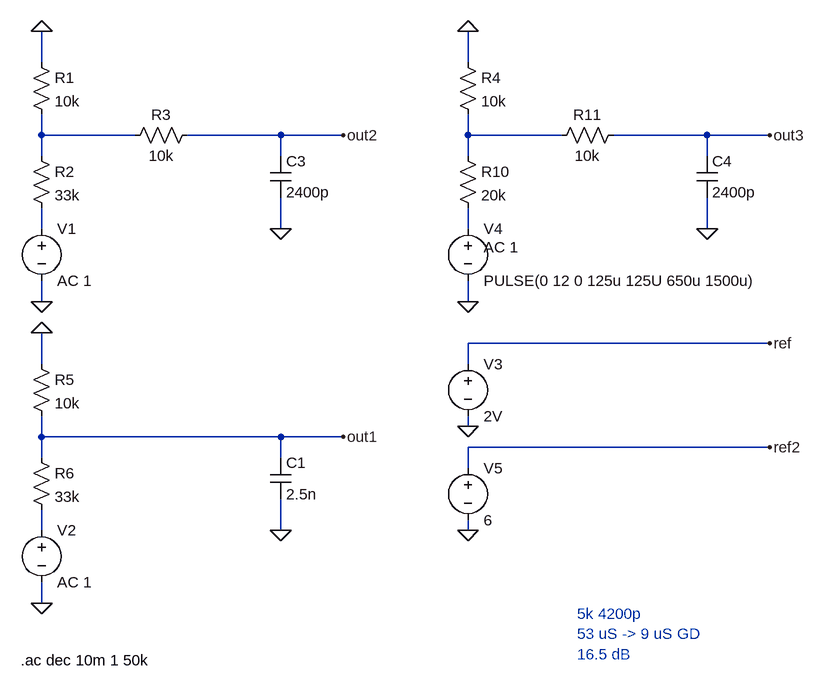
[diagram p0: schematic BEMF_Filter.asc]
BEMF_Filter.asc, the LTspice schematic file:
Version 4
SHEET 1 1400 680
WIRE 48 -960 48 -1008
WIRE 704 -960 704 -1008
WIRE 48 -848 48 -880
WIRE 192 -848 48 -848
WIRE 416 -848 272 -848
WIRE 512 -848 416 -848
WIRE 704 -848 704 -880
WIRE 848 -848 704 -848
WIRE 1072 -848 928 -848
WIRE 1168 -848 1072 -848
WIRE 48 -816 48 -848
WIRE 416 -816 416 -848
WIRE 704 -816 704 -848
WIRE 1072 -816 1072 -848
WIRE 48 -704 48 -736
WIRE 416 -704 416 -752
WIRE 704 -704 704 -736
WIRE 1072 -704 1072 -752
WIRE 48 -592 48 -624
WIRE 704 -592 704 -624
WIRE 1168 -528 704 -528
WIRE 48 -496 48 -544
WIRE 704 -496 704 -528
WIRE 704 -400 704 -416
WIRE 48 -384 48 -416
WIRE 416 -384 48 -384
WIRE 512 -384 416 -384
WIRE 1168 -368 704 -368
WIRE 48 -352 48 -384
WIRE 416 -352 416 -384
WIRE 704 -336 704 -368
WIRE 48 -240 48 -272
WIRE 416 -240 416 -288
WIRE 704 -240 704 -256
WIRE 48 -128 48 -160
FLAG 48 -128 0
FLAG 416 -240 0
FLAG 48 -544 0
FLAG 512 -384 out1
FLAG 48 -592 0
FLAG 416 -704 0
FLAG 48 -1008 0
FLAG 512 -848 out2
FLAG 704 -592 0
FLAG 1072 -704 0
FLAG 704 -1008 0
FLAG 1168 -848 out3
FLAG 704 -400 0
FLAG 1168 -528 ref
FLAG 704 -240 0
FLAG 1168 -368 ref2
SYMBOL voltage 48 -256 R0
WINDOW 123 0 0 Left 0
WINDOW 39 0 0 Left 0
SYMATTR InstName V2
SYMATTR Value AC 1
SYMBOL cap 400 -352 R0
SYMATTR InstName C1
SYMATTR Value 2.5n
SYMBOL res 32 -512 R0
SYMATTR InstName R5
SYMATTR Value 10k
SYMBOL res 32 -368 R0
SYMATTR InstName R6
SYMATTR Value 33k
SYMBOL voltage 48 -720 R0
WINDOW 123 0 0 Left 0
WINDOW 39 0 0 Left 0
SYMATTR InstName V1
SYMATTR Value AC 1
SYMBOL cap 400 -816 R0
SYMATTR InstName C3
SYMATTR Value 2400p
SYMBOL res 32 -976 R0
SYMATTR InstName R1
SYMATTR Value 10k
SYMBOL res 32 -832 R0
SYMATTR InstName R2
SYMATTR Value 33k
SYMBOL res 288 -864 R90
WINDOW 0 0 56 VBottom 2
WINDOW 3 32 56 VTop 2
SYMATTR InstName R3
SYMATTR Value 10k
SYMBOL voltage 704 -720 R0
WINDOW 123 24 44 Left 2
WINDOW 39 0 0 Left 0
SYMATTR Value2 AC 1
SYMATTR InstName V4
SYMATTR Value PULSE(0 12 0 125u 125U 650u 1500u)
SYMBOL cap 1056 -816 R0
SYMATTR InstName C4
SYMATTR Value 2400p
SYMBOL res 688 -976 R0
SYMATTR InstName R4
SYMATTR Value 10k
SYMBOL res 688 -832 R0
SYMATTR InstName R10
SYMATTR Value 20k
SYMBOL res 944 -864 R90
WINDOW 0 0 56 VBottom 2
WINDOW 3 32 56 VTop 2
SYMATTR InstName R11
SYMATTR Value 10k
SYMBOL voltage 704 -512 R0
WINDOW 123 0 0 Left 0
WINDOW 39 0 0 Left 0
SYMATTR InstName V3
SYMATTR Value 2V
SYMBOL voltage 704 -352 R0
WINDOW 123 0 0 Left 0
WINDOW 39 0 0 Left 0
SYMATTR InstName V5
SYMATTR Value 6
TEXT 872 -112 Left 2 ;5k 4200p\n53 uS -> 9 uS GD\n16.5 dB
TEXT 16 -40 Left 2 !.ac dec 10m 1 50k

The netlist it stands for:
* BEMF_Filter.asc
V2 N005 0 AC 1
C1 out1 0 2.5n
R5 0 out1 10k
R6 out1 N005 33k
V1 N003 0 AC 1
C3 out2 0 2400p
R1 0 N001 10k
R2 N001 N003 33k
R3 out2 N001 10k
V4 N004 0 PULSE(0 12 0 125u 125U 650u 1500u) AC 1
C4 out3 0 2400p
R4 0 N002 10k
R10 N002 N004 20k
R11 out3 N002 10k
V3 ref 0 2V
V5 ref2 0 6
* 5k 4200p
* 53 uS -> 9 uS GD
* 16.5 dB
.ac dec 10m 1 50k
.backanno
.end

* Results of the author's LTspice run, read from the files saved beside the schematic
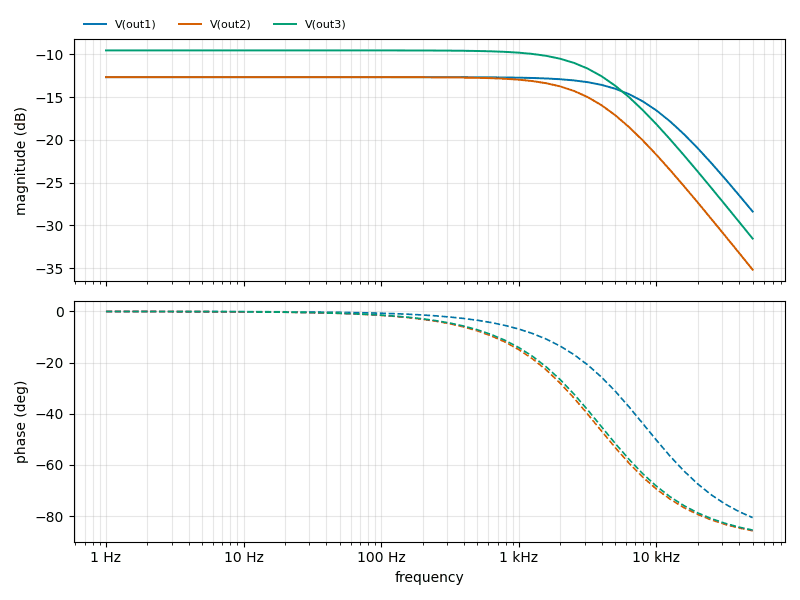
[diagram p1: AC Analysis of BEMF_Filter.asc, plotted from the saved traces]
* AC Analysis, 1 run:
*   V(out1): -12.67 dB at 1 Hz, -28.39 dB at 50 kHz, peak -12.67 dB at 1 Hz, 3 dB below the peak at 8.264 kHz
*   V(out2): -12.67 dB at 1 Hz, -35.19 dB at 50 kHz, peak -12.67 dB at 1 Hz, 3 dB below the peak at 3.732 kHz
*   V(out3): -9.54 dB at 1 Hz, -31.55 dB at 50 kHz, peak -9.54 dB at 1 Hz, 3 dB below the peak at 3.979 kHz